# EAGLE design MRCS-Adapter-CRMI8-RJ45-Inverting (EAGLE 7.7.0)
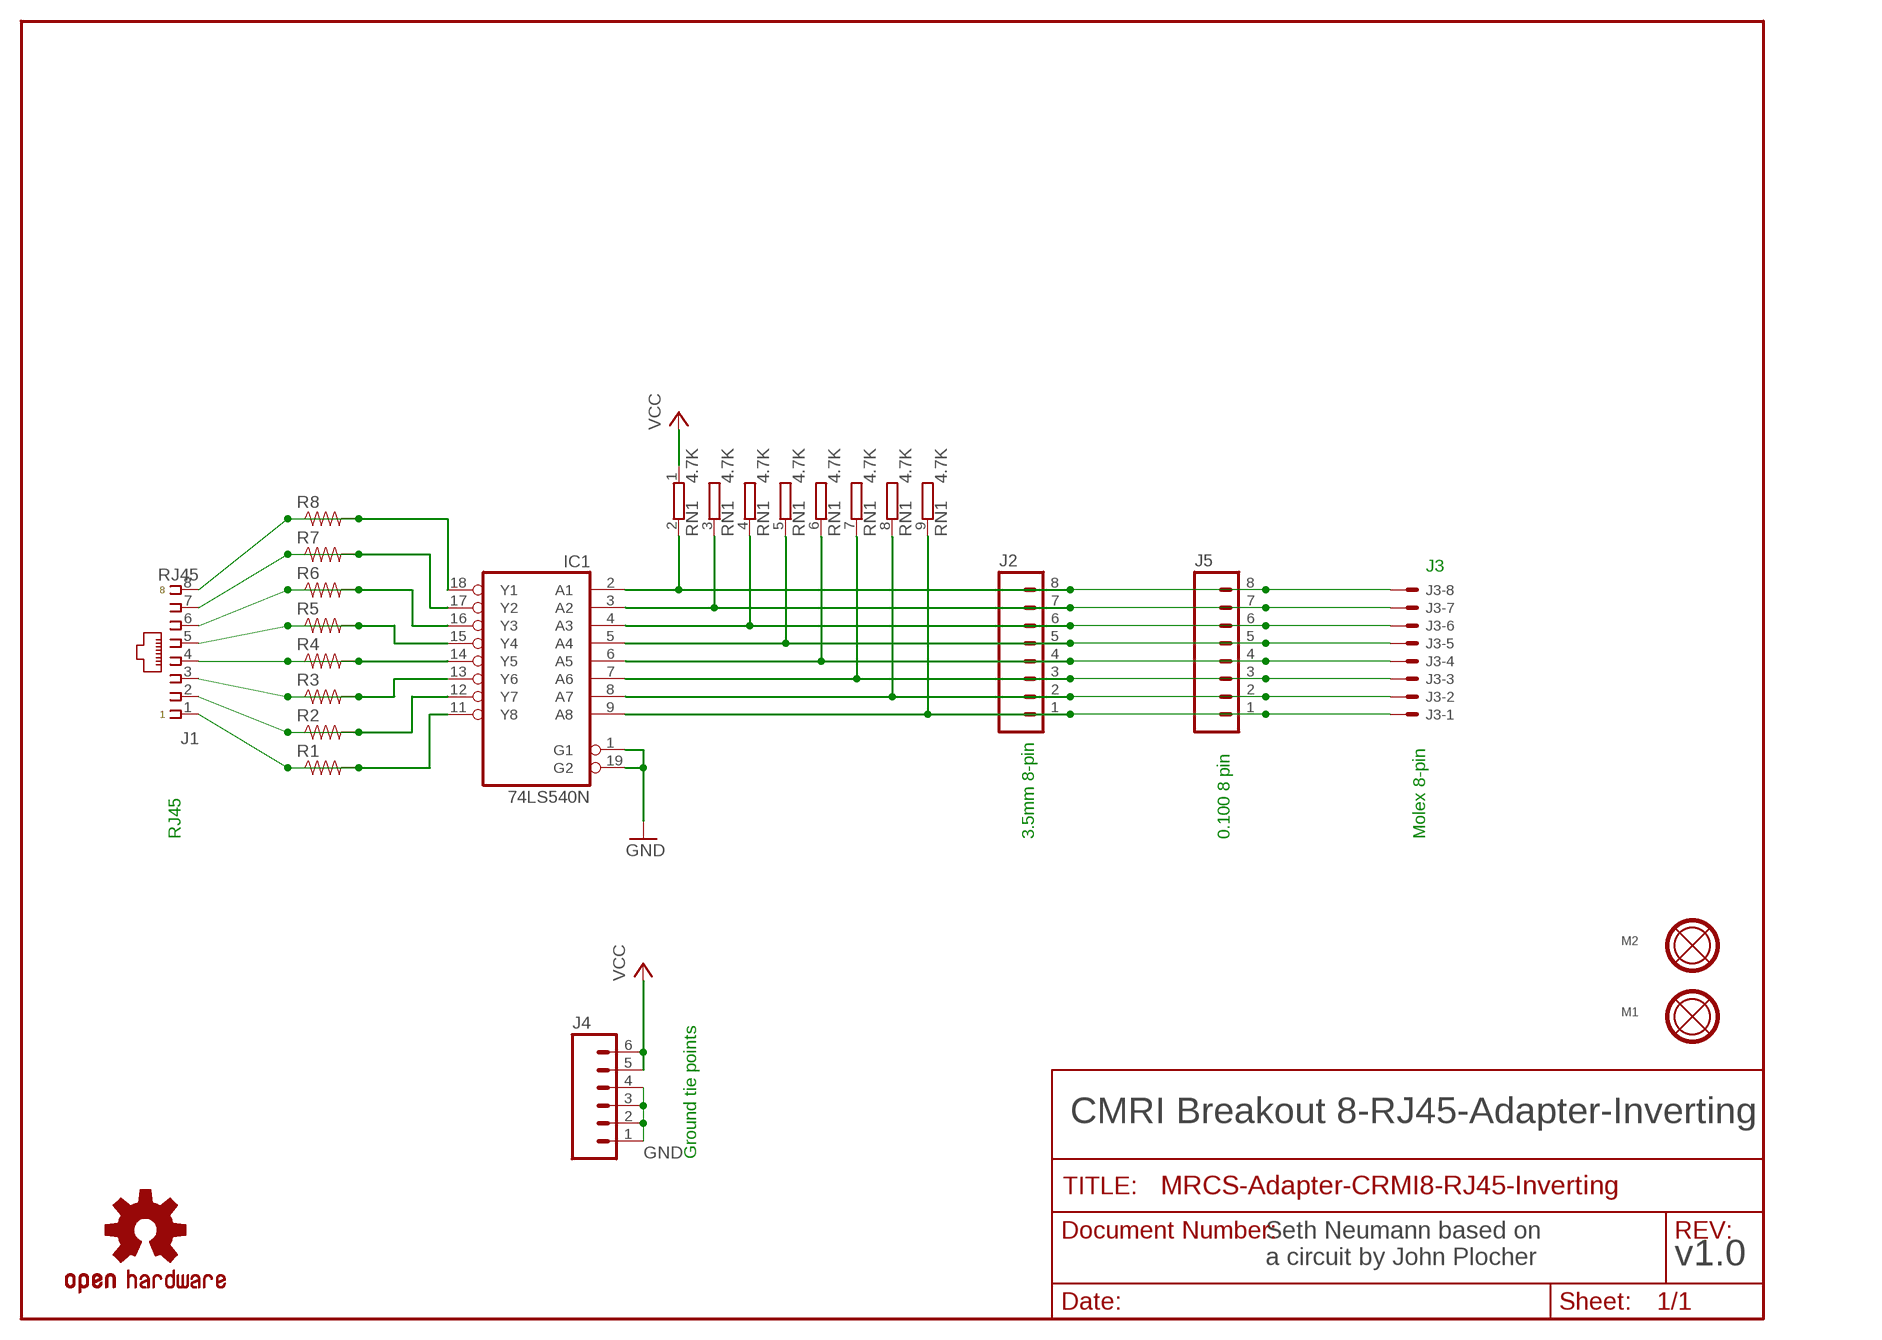
[diagram p0: schematic, sheet 1]

## Parts
IC1  74LS540N  [DIL20]
J1  RJ45  CONNECTOR-RJ45-FRONT  [RJ45-NO-SHIELD]
J2  CONNECTOR-M083.5MM-8  [SCREWTERMINAL-3.5MM-8]
J3  KK-156-8F  [KK-156-8-F]
J4  CONNECTOR-M06LOCK  [1X06_LOCK]
J5  CONNECTOR-M08LOCK  [1X08_LOCK]
M1  MOUNTINGHOLE  [MOUNTINGHOLE]
M2  MOUNTINGHOLE  [MOUNTINGHOLE]
R1  RPTH04  [AXIAL-0.4-RES]
R2  RPTH04  [AXIAL-0.4-RES]
R3  RPTH04  [AXIAL-0.4-RES]
R4  RPTH04  [AXIAL-0.4-RES]
R5  RPTH04  [AXIAL-0.4-RES]
R6  RPTH04  [AXIAL-0.4-RES]
R7  RPTH04  [AXIAL-0.4-RES]
R8  RPTH04  [AXIAL-0.4-RES]
RN1  4.7K  GE08RP  [SIL9]
U$1  DOC-OSHW-LOGO-L  [OSHW-LOGO-L]

## Nets
GND: IC1.1(G1) IC1.19(G2) J4.1 J4.2 J4.3 J4.4
L1: IC1.9(A8) J2.1 J3.1 J5.1 RN1.9
L2: IC1.8(A7) J2.2 J3.2 J5.2 RN1.8
L3: IC1.7(A6) J2.3 J3.3 J5.3 RN1.7
L4: IC1.6(A5) J2.4 J3.4 J5.4 RN1.6
L5: IC1.5(A4) J2.5 J3.5 J5.5 RN1.5
L6: IC1.4(A3) J2.6 J3.6 J5.6 RN1.4
L7: IC1.3(A2) J2.7 J3.7 J5.7 RN1.3
L8: IC1.2(A1) J2.8 J3.8 J5.8 RN1.2
N$2: IC1.18(Y1) J1.8 R8.P$1 R8.P$2
N$3: IC1.17(Y2) J1.7 R7.P$1 R7.P$2
N$4: IC1.16(Y3) J1.6 R6.P$1 R6.P$2
N$5: IC1.15(Y4) J1.5 R5.P$1 R5.P$2
N$6: IC1.14(Y5) J1.4 R4.P$1 R4.P$2
N$7: IC1.13(Y6) J1.3 R3.P$1 R3.P$2
N$8: IC1.12(Y7) J1.2 R2.P$1 R2.P$2
N$9: IC1.11(Y8) J1.1 R1.P$1 R1.P$2
VCC: J4.5 J4.6 RN1.1

## Notes on the sheet
- J3
- RJ45 | 3.5mm 8-pin | 0.100 8 pin | Molex 8-pin
- CMRI Breakout 8-RJ45-Adapter-Inverting
- Ground tie points
- Seth Neumann based on 
  a circuit by John Plocher
- v1.0

## Power pins joined to a net without a drawn wire
GND: IC1.10(GND)
VCC: IC1.20(VCC)

## Library data of the parts
IC1 = 74xx-us:74*540: Inverting Octal BUFFER and LINE DRIVER, 3-state
J1 = SPCoast:CONNECTOR-RJ45: CORCOM Modular RJ Jacks No Shield Source: www.tycoelectronics.com .. ENG_DS_1654001_1099_RJ_L_0507.pdf; AMP: 520151-4; OPL: none
J2 J5 = SPCoast:CONNECTOR-M08: Header 8 Standard 8-pin 0.1" header. Use with straight break away headers (SKU : PRT-00116), right angle break away headers (PRT-00553), swiss pins (PRT-00743), machine pins (PRT-00117), and female headers (PRT-00115).
J3 = SPCoast:KK-156-8: KK 156 HEADER Source: http://www.molex.com/pdm_docs/sd/026604100_sd.pdf; OC_FARNELL: unknown; OC_NEWARK: unknown
J4 = SPCoast:CONNECTOR-M06: Header 6 Standard 6-pin 0.1" header
M1 M2 = SPCoast:MOUNTINGHOLE: Mounting hole with top and bottom copper and stop rings
R1-R8 = SPCoast:R*: Resistor Basic schematic elements and footprints for 0603, 1206, and PTH 1/10th watt (small) resistors.
RN1 = resistor-sil:GE08RP: SIL RESISTOR; OC_FARNELL: unknown; OC_NEWARK: unknown
U$1 = SPCoast:DOC-OSHW-LOGO-: Open Source Hardware Logo This logo indicates the piece of hardware it is found on incorporates a OSHW license and/or adheres to the definition of open source hardware http://freedomdefined.org/OSHW Creative Commons - Attribution - ShareAlike 3.0

## Net classes
0 default: width 0.254 mm

## Board
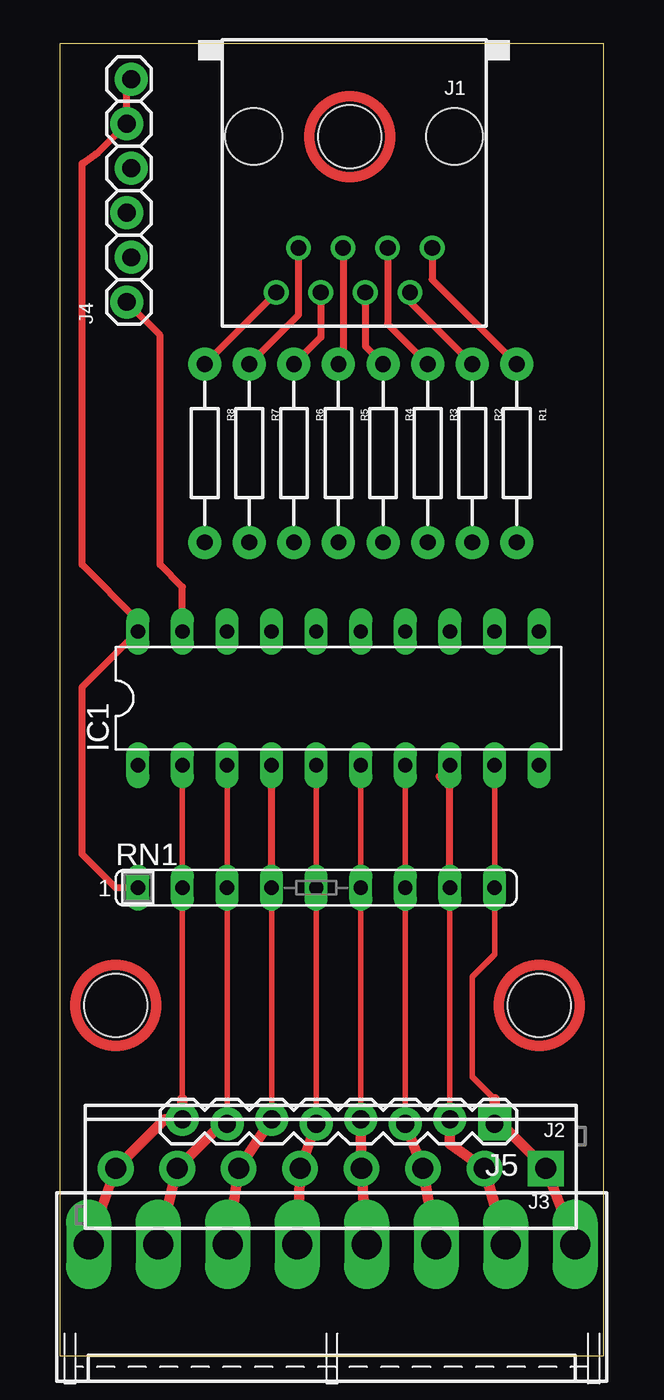
[diagram p1: board, top side]
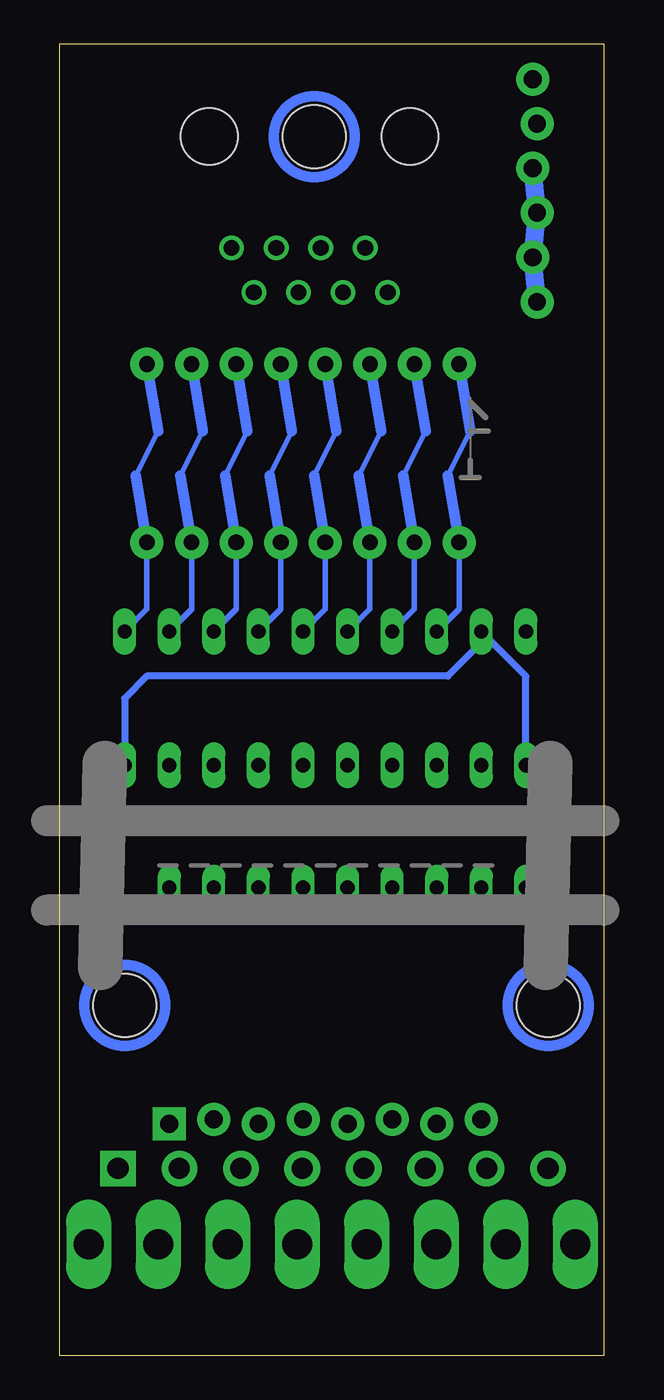
[diagram p2: board, bottom side, seen from below]

Size 31 x 74.77 mm. Coordinates in mm from the lower left corner, seen from the top.
Outline: 0,0 31,0 31,74.77 0,74.77 0,0
Copper layers (1*16): Top 0.035mm / dielectric 1.5mm / Bottom 0.035mm
Design rules "Fusion_eagle_rule_v1.1": minimum track width 6mil, minimum drill 12mil, track to track 6mil, track to pad 6mil, pad to pad 6mil, via to via 6mil, smd to smd 0mil, copper to edge 10mil, drill to drill 10mil, minimum pad ring 10mil, minimum via ring 6mil, stop-mask expansion 2mil, vias tented up to drill 100mil, thermal gap 10mil

### Footprints (pad centres in the part's own frame; a part is rotated, then mirrored left to right if it is on the bottom)
DIL20 = drill 0.813 long: 1 -11.43,-3.81; 2 -8.89,-3.81; 3 -6.35,-3.81; 4 -3.81,-3.81; 5 -1.27,-3.81; 6 1.27,-3.81; 7 3.81,-3.81; 8 6.35,-3.81; 9 8.89,-3.81; 10 11.43,-3.81; 11 11.43,3.81; 12 8.89,3.81; 13 6.35,3.81; 14 3.81,3.81; 15 1.27,3.81; 16 -1.27,3.81; 17 -3.81,3.81; 18 -6.35,3.81; 19 -8.89,3.81; 20 -11.43,3.81
RJ45-NO-SHIELD = drill 0.9 pad 1.4: 1 -4.445,6.35; 2 -3.175,8.89; 3 -1.905,6.35; 4 -0.635,8.89; 5 0.635,6.35; 6 1.905,8.89; 7 3.175,6.35; 8 4.445,8.89 | hole 3.251: -5.715,0; 5.715,0
SCREWTERMINAL-3.5MM-8 = drill 1.2 pad 2.032 square: 1 0,0 | drill 1.2 pad 2.032: 2 3.5,0; 3 7,0; 4 10.5,0; 5 14,0; 6 17.5,0; 7 21,0; 8 24.5,0
KK-156-8-F = drill 1.7 pad 2.184 long: 1 -13.86,0; 2 -9.9,0; 3 -5.94,0; 4 -1.98,0; 5 1.98,0; 6 5.94,0; 7 9.9,0; 8 13.86,0
1X06_LOCK = drill 1.016 pad 1.88: 1 0,0; 2 2.54,-0.254; 3 5.08,0; 4 7.62,-0.254; 5 10.16,0; 6 12.7,-0.254
1X08_LOCK = drill 1.016 pad 1.88 square: 1 0,0.127 | drill 1.016 pad 1.88: 2 2.54,-0.127; 3 5.08,0.127; 4 7.62,-0.127; 5 10.16,0.127; 6 12.7,-0.127; 7 15.24,0.127; 8 17.78,-0.127
MOUNTINGHOLE = hole 3.6: 0,0
AXIAL-0.4-RES = drill 0.9 pad 1.88: P$1 -5.08,0; P$2 5.08,0
SIL9 = drill 0.813 long: 1 -10.16,0; 2 -7.62,0; 3 -5.08,0; 4 -2.54,0; 5 0,0; 6 2.54,0; 7 5.08,0; 8 7.62,0; 9 10.16,0

### Placement (x,y rotation side)
IC1  15.88,37.47 0 top
J1  16.77,69.48 180 top
J2  27.69,10.67 180 top
J3  15.5,6.35 180 top
J4  3.81,60.05 90 top
J5  24.77,13.34 180 top
M1  16.51,69.48 0 top
M2  27.3,19.95 0 top
M3  MOUNTINGHOLE  [MOUNTINGHOLE]  3.17,19.95 0 top
R1  26.04,51.44 270 top
R2  23.5,51.44 270 top
R3  20.95,51.44 270 top
R4  18.41,51.44 270 top
R5  15.88,51.44 270 top
R6  13.34,51.44 270 top
R7  10.79,51.44 270 top
R8  8.26,51.44 270 top
RN1  14.61,26.67 0 top
U$1  16.51,69.48 0 top
U$2  [CA-PROP65WARNING]  18.41,17.78 0 top
U$3  [MRCSLOGOBTM]  1.27,49.53 0 top

### Tracks (layer width: path | path; a pad name or v marks a point on that pad's centre or on a via)
GND
  Top 0.406: IC1.19 6.99,43.81 5.71,45.09 5.71,58.15 J4.1
  Bottom 0.406: IC1.1 4.45,38.73 IC1.19 6.99,40.64 8.89,38.73 26.04,38.73 27.3,37.47 IC1.10
  Bottom 1.016: J4.1 J4.2 J4.3 J4.4
L1
  Top 0.305: IC1.9 24.77,27.3 | RN1.9 24.77,22.86 23.5,21.59 23.5,15.88 24.77,14.61
  Top 0.406: RN1.9 24.77,27.3
  Top 0.61: J3.1 J2.1 25.15,13.21 J5.1 24.77,14.61
L2
  Top 0.305: IC1.8 RN1.8 J5.2
  Top 0.406: RN1.8 22.23,32.38 21.59,33.02
  Top 0.61: J3.2 J2.2 22.23,12.06 J5.2
L3
  Top 0.305: IC1.7 RN1.7 | 19.68,26.04 J5.3
  Top 0.406: RN1.7 19.68,26.04
  Top 0.61: J3.3 J2.3 19.94,12.55 | J5.3 19.94,12.55 | 19.68,12.81 19.94,12.55
L4
  Top 0.305: IC1.6 RN1.6 | 17.14,26.04 J5.4
  Top 0.406: RN1.6 17.14,26.04
  Top 0.61: J3.4 J2.4 J5.4
L5
  Top 0.305: IC1.5 RN1.5 | 14.61,26.04 J5.5
  Top 0.406: RN1.5 14.61,26.04
  Top 0.61: J3.5 J2.5 J5.5
L6
  Top 0.305: IC1.4 12.06,32.38 | RN1.4 J5.6
  Top 0.406: RN1.4 12.06,32.38
  Top 0.61: J3.6 J2.6 J5.6
L7
  Top 0.305: IC1.3 9.53,27.3 | RN1.3 J5.7
  Top 0.406: RN1.3 9.53,27.3
  Top 0.61: J3.7 J2.7 9.23,13.21 J5.7
L8
  Top 0.305: IC1.2 RN1.2 | 6.99,26.04 6.99,13.97
  Top 0.406: RN1.2 6.99,26.04
  Top 0.61: J3.8 J2.8 5.98,13.46 J5.8 6.99,13.97 6.99,14.61
N$2
  Top 0.406: J1.8 R8.P$1
  Bottom 0.254: 7.62,52.7 8.89,50.16
  Bottom 0.305: R8.P$2 8.26,42.55 IC1.18
  Bottom 0.61: R8.P$1 7.62,52.7 | R8.P$2 8.89,50.16
N$3
  Top 0.406: J1.7 13.6,59.31 R7.P$1
  Bottom 0.254: 10.16,52.7 11.43,50.16
  Bottom 0.305: R7.P$2 10.79,42.55 IC1.17
  Bottom 0.61: R7.P$1 10.16,52.7 | R7.P$2 11.43,50.16
N$4
  Top 0.406: J1.6 14.87,58.05 R6.P$1
  Bottom 0.254: 12.7,52.7 13.97,50.16
  Bottom 0.305: R6.P$2 13.34,42.55 IC1.16
  Bottom 0.61: R6.P$1 12.7,52.7 | R6.P$2 13.97,50.16
N$5
  Top 0.406: J1.5 16.14,56.77 R5.P$1
  Bottom 0.254: 15.24,52.7 16.51,50.16
  Bottom 0.305: R5.P$2 15.88,42.55 IC1.15
  Bottom 0.61: R5.P$1 15.24,52.7 | R5.P$2 16.51,50.16
N$6
  Top 0.406: J1.4 17.41,57.52 R4.P$1
  Bottom 0.254: 17.78,52.7 19.05,50.16
  Bottom 0.305: R4.P$2 18.41,42.55 IC1.14
  Bottom 0.61: R4.P$1 17.78,52.7 | R4.P$2 19.05,50.16
N$7
  Top 0.406: J1.3 18.68,58.8 R3.P$1
  Bottom 0.254: 20.32,52.7 21.59,50.16
  Bottom 0.305: R3.P$2 20.95,42.55 IC1.13
  Bottom 0.61: R3.P$1 20.32,52.7 | R3.P$2 21.59,50.16
N$8
  Top 0.406: J1.2 19.95,60.06 R2.P$1
  Bottom 0.254: 22.86,52.7 24.13,50.16
  Bottom 0.305: R2.P$2 23.5,42.55 IC1.12
  Bottom 0.61: R2.P$1 22.86,52.7 | R2.P$2 24.13,50.16
N$9
  Top 0.406: J1.1 21.21,61.34 R1.P$1
  Bottom 0.254: 25.4,52.7 26.67,50.16
  Bottom 0.305: R1.P$2 26.04,42.55 IC1.11
  Bottom 0.61: R1.P$1 25.4,52.7 | R1.P$2 26.67,50.16
VCC
  Top 0.406: J4.6 3.81,72.5 J4.5 2.17,68.58 1.27,67.94 1.27,45.09 4.45,41.91 IC1.20 1.27,38.1 1.27,28.57 3.17,26.67 RN1.1

### Text on the board
tDocu: VCC / VCC / GND / GND / GND / GND | Cut on / reverse for / Resistors | 8 | CMRI8-RJ45 Inverting Adapter | 2020.11 | v1.0 | 0.100 | 3.5mm | 8 | 1 | 0.156
bDocu: Solder / Side | MRCS | CMRI RJ45 Inverting | CMRI Inverting RJ45 Breakout
_tNames: J1 | J4 | R8 | R7 | R6 | R5 | R4 | R3 | R2 | R1 | IC1 | RN1 | J5 | J2 | J3